# EAGLE schematic draft1 (EAGLE 6.3)
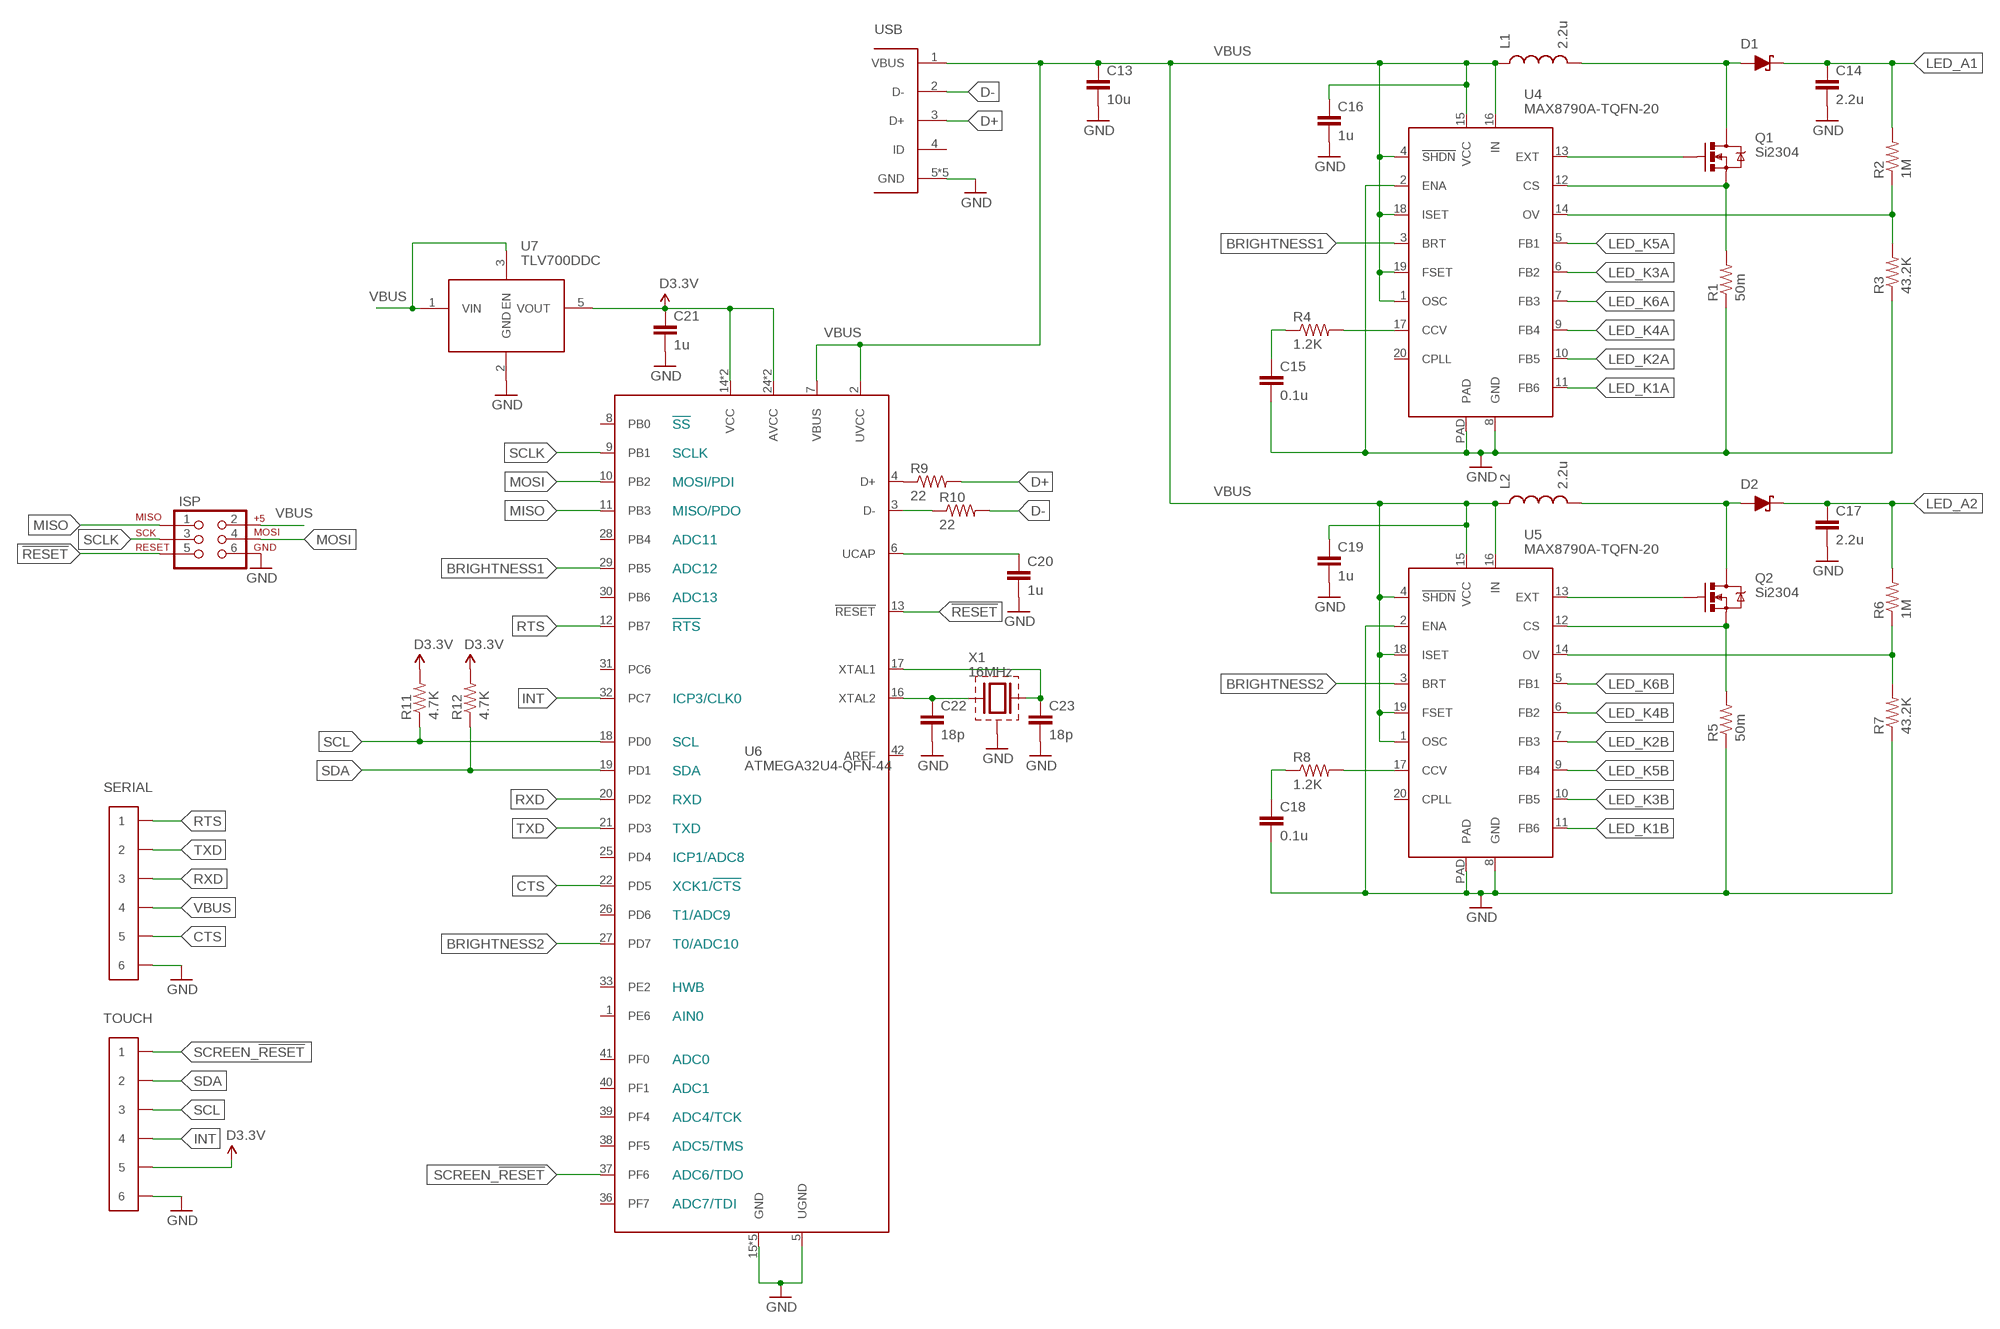
[diagram p0: schematic, sheet 1, part 1 of 2]
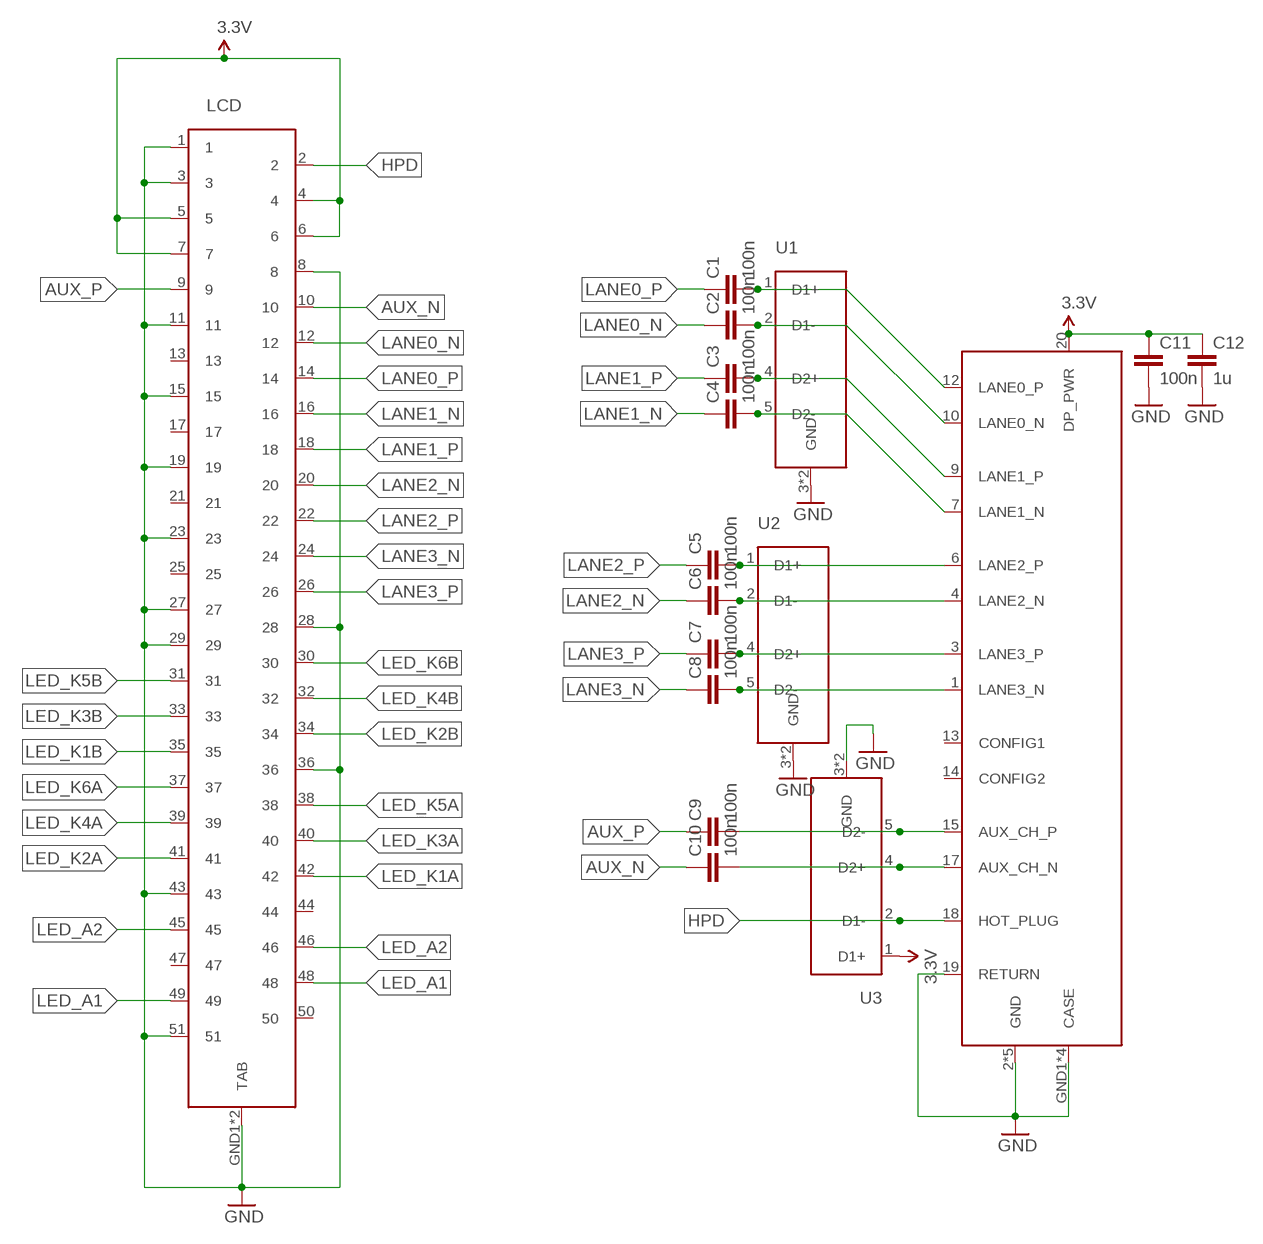
[diagram p1: schematic, sheet 1, part 2 of 2]

## Parts
C1  100n  C-EUC0402  [C0402]
C2  100n  C-EUC0402  [C0402]
C3  100n  C-EUC0402  [C0402]
C4  100n  C-EUC0402  [C0402]
C5  100n  C-EUC0402  [C0402]
C6  100n  C-EUC0402  [C0402]
C7  100n  C-EUC0402  [C0402]
C8  100n  C-EUC0402  [C0402]
C9  100n  C-EUC0402  [C0402]
C10  100n  C-EUC0402  [C0402]
C11  100n  C-EUC0805  [C0805]
C12  1u  C-EUC0805  [C0805]
C13  10u  C-EUC1206  [C1206]
C14  2.2u  C-EUC1206  [C1206]
C15  0.1u  C-EUC0603  [C0603]
C16  1u  C-EUC0603  [C0603]
C17  2.2u  C-EUC1206  [C1206]
C18  0.1u  C-EUC0603  [C0603]
C19  1u  C-EUC0603  [C0603]
C20  1u  C-EUC0603  [C0603]
C21  1u  C-EUC0603  [C0603]
C22  18p  C-EUC0603  [C0603]
C23  18p  C-EUC0603  [C0603]
D1  DB2W40300L  DIODE-SCHOTTKY-MINI2-F3-B  [MINI2-F3-B]
D2  DB2W40300L  DIODE-SCHOTTKY-MINI2-F3-B  [MINI2-F3-B]
DP  DISPLAYPORT-SINK-MOLEX  [MOLEX-47272-0028]
ISP  AVR_SPI_PRG_6PTH  [2X3]
L1  2.2u  INDUCTOR1210  [1210]
L2  2.2u  INDUCTOR1210  [1210]
LCD  CONN-51P-FPC-MOLEX  [MOLEX-502250-5191]
Q1  Si2304  MOSFET-NCHANNELSMD  [SOT23-3]
Q2  Si2304  MOSFET-NCHANNELSMD  [SOT23-3]
R1  50m  R-US_MCS1632  [MCS1632]
R2  1M  R-US_R0603  [R0603]
R3  43.2K  R-US_R0603  [R0603]
R4  1.2K  R-US_R0603  [R0603]
R5  50m  R-US_MCS1632  [MCS1632]
R6  1M  R-US_R0603  [R0603]
R7  43.2K  R-US_R0603  [R0603]
R8  1.2K  R-US_R0603  [R0603]
R9  22  R-US_R0603  [R0603]
R10  22  R-US_R0603  [R0603]
R11  4.7K  R-US_R0603  [R0603]
R12  4.7K  R-US_R0603  [R0603]
SERIAL  HEADER-6X1-961106-5500  [HEADER-3M-961-6P-2.54MM]
TOUCH  HEADER-6X1-FPC-DUAL_CONTACT  [MOLEX-503480-0600]
U1  ESD-SUPPRESSOR-4-TPD4S010-DQA  [SON-10]
U2  ESD-SUPPRESSOR-4-TPD4S010-DQA  [SON-10]
U3  ESD-SUPPRESSOR-4-TPD4S010-DQA  [SON-10]
U4  MAX8790A-TQFN-20  [TQFN-20]
U5  MAX8790A-TQFN-20  [TQFN-20]
U6  ATMEGA32U4-QFN-44  [QFN-44]
U7  TLV700DDC  [SOT-23-5]
USB  USB_MICRO_AB  [USB_MICRO_AB]
X1  16MHz  XTAL-ABRACONABM3C  [ABM3C]

## Nets
3.3V: C11.1 C12.1 DP.20(DP_PWR) LCD.4 LCD.5 LCD.6 LCD.7 U3.1(D1+)
!RESET: ISP.5 U6.13(!RESET)
AUX_N: C10.1 LCD.10
AUX_P: C9.1 LCD.9
BRIGHTNESS1: U4.3(BRT) U6.29(PB5)
BRIGHTNESS2: U5.3(BRT) U6.27(PD7)
CTS: SERIAL.5 U6.22(PD5)
D3.3V: C21.1 R11.2 R12.2 TOUCH.5 U6.14(VCC) U6.24(AVCC) U6.34(VCC) U6.44(AVCC) U7.5(VOUT)
D+: R9.2 USB.3(D+)
D-: R10.2 USB.2(D-)
GND: C11.2 C12.2 C13.2 C14.2 C15.2 C16.2 C17.2 C18.2 C19.2 C20.2 C21.2 C22.2 C23.2 DP.2(GND) DP.5(GND) DP.8(GND) DP.11(GND) DP.16(GND) DP.19(RETURN) DP.GND1(CASE) DP.GND2(CASE) DP.GND3(CASE) DP.GND4(CASE) ISP.6 LCD.1 LCD.3 LCD.8 LCD.11 LCD.15 LCD.19 LCD.23 LCD.27 LCD.28 LCD.29 LCD.36 LCD.43 LCD.51 LCD.GND1(TAB) LCD.GND2(TAB) R1.1 R3.1 R5.1 R7.1 SERIAL.6 TOUCH.6 U1.3(GND) U1.8(GND) U2.3(GND) U2.8(GND) U3.3(GND) U3.8(GND) U4.2(ENA) U4.8(GND) U4.PAD U5.2(ENA) U5.8(GND) U5.PAD U6.5(UGND) U6.15(GND) U6.23(GND) U6.35(GND) U6.43(GND) U6.PAD(GND) U7.2(GND) USB.5(GND) USB.GND1(GND) USB.GND2(GND) USB.GND3(GND) USB.GND4(GND) X1.2(CASE) X1.4(CASE)
HPD: DP.18(HOT_PLUG) LCD.2 U3.2(D1-)
INT: TOUCH.4 U6.32(PC7)
LANE0_N: C2.1 LCD.12
LANE0_P: C1.1 LCD.14
LANE1_N: C4.1 LCD.16
LANE1_P: C3.1 LCD.18
LANE2_N: C6.1 LCD.20
LANE2_P: C5.1 LCD.22
LANE3_N: C8.1 LCD.24
LANE3_P: C7.1 LCD.26
LED_A1: C14.1 D1.1(K) LCD.48 LCD.49 R2.2
LED_A2: C17.1 D2.1(K) LCD.45 LCD.46 R6.2
LED_K1A: LCD.42 U4.11(FB6)
LED_K1B: LCD.35 U5.11(FB6)
LED_K2A: LCD.41 U4.10(FB5)
LED_K2B: LCD.34 U5.7(FB3)
LED_K3A: LCD.40 U4.6(FB2)
LED_K3B: LCD.33 U5.10(FB5)
LED_K4A: LCD.39 U4.9(FB4)
LED_K4B: LCD.32 U5.6(FB2)
LED_K5A: LCD.38 U4.5(FB1)
LED_K5B: LCD.31 U5.9(FB4)
LED_K6A: LCD.37 U4.7(FB3)
LED_K6B: LCD.30 U5.5(FB1)
MISO: ISP.1 U6.11(PB3)
MOSI: ISP.4 U6.10(PB2)
N$1: C4.2 DP.7(LANE1_N) U1.5(D2-)
N$2: C3.2 DP.9(LANE1_P) U1.4(D2+)
N$3: C2.2 DP.10(LANE0_N) U1.2(D1-)
N$4: C1.2 DP.12(LANE0_P) U1.1(D1+)
N$5: C5.2 DP.6(LANE2_P) U2.1(D1+)
N$6: C6.2 DP.4(LANE2_N) U2.2(D1-)
N$7: C7.2 DP.3(LANE3_P) U2.4(D2+)
N$8: C8.2 DP.1(LANE3_N) U2.5(D2-)
N$9: C9.2 DP.15(AUX_CH_P) U3.5(D2-)
N$10: C10.2 DP.17(AUX_CH_N) U3.4(D2+)
N$11: Q1.2(S) R1.2 U4.12(CS)
N$12: Q2.1(G) U5.13(EXT)
N$13: Q1.1(G) U4.13(EXT)
N$14: D1.2(A) L1.2 Q1.3(D)
N$15: R2.1 R3.2 U4.14(OV)
N$16: R4.2 U4.17(CCV)
N$17: C15.1 R4.1
N$18: D2.2(A) L2.2 Q2.3(D)
N$19: Q2.2(S) R5.2 U5.12(CS)
N$20: R6.1 R7.2 U5.14(OV)
N$21: R8.2 U5.17(CCV)
N$22: C18.1 R8.1
N$23: R9.1 U6.4(D+)
N$24: R10.1 U6.3(D-)
N$25: C20.1 U6.6(UCAP)
N$26: C22.1 U6.16(XTAL2) X1.1
N$27: C23.1 U6.17(XTAL1) X1.3
RTS: SERIAL.1 U6.12(PB7)
RXD: SERIAL.3 U6.20(PD2)
SCL: R11.1 TOUCH.3 U6.18(PD0)
SCLK: ISP.3 U6.9(PB1)
SCREEN_!RESET: TOUCH.1 U6.37(PF6)
SDA: R12.1 TOUCH.2 U6.19(PD1)
TXD: SERIAL.2 U6.21(PD3)
VBUS: C13.1 C16.1 C19.1 ISP.2 L1.1 L2.1 SERIAL.4 U4.1(OSC) U4.4(!SHDN) U4.15(VCC) U4.16(IN) U4.18(ISET) U4.19(FSET) U5.1(OSC) U5.4(!SHDN) U5.15(VCC) U5.16(IN) U5.18(ISET) U5.19(FSET) U6.2(UVCC) U6.7(VBUS) U7.1(VIN) U7.3(EN) USB.1(VBUS)
Unconnected: DP.13(CONFIG1) DP.14(CONFIG2) LCD.13 LCD.17 LCD.21 LCD.25 LCD.44 LCD.47 LCD.50 U4.20(CPLL) U5.20(CPLL) U6.1(PE6) U6.8(PB0) U6.25(PD4) U6.26(PD6) U6.28(PB4) U6.30(PB6) U6.31(PC6) U6.33(PE2) U6.36(PF7) U6.38(PF5) U6.39(PF4) U6.40(PF1) U6.41(PF0) U6.42(AREF) USB.4(ID)

## Library data of the parts
C1-C23 = 00-EvaLibrary:C-EU: CAPACITOR, European symbol
D1 D2 = 00-EvaLibrary:DIODE-SCHOTTKY
DP = 00-EvaLibrary:DISPLAYPORT
ISP = SparkFun-Connectors:AVR_SPI_PRG_6: AVR ISP 6 Pin This is the reduced ISP connector for AVR programming. Common on Arduino. This footprint will take up less PCB space and can be used with a 10-pin to 6-pin adapter such as SKU: BOB-08508
L1 L2 = 00-EvaLibrary:INDUCTOR: Inductors Basic Inductor/Choke - 0603 and 1206. Footprints are not proven and vary greatly between part numbers.
LCD = 00-EvaLibrary:CONN-51P
Q1 Q2 = SparkFun-DiscreteSemi:MOSFET-NCHANNEL: Generic NMOS footprint
R1-R12 = 00-EvaLibrary:R-US_: RESISTOR, American symbol
SERIAL TOUCH = 00-EvaLibrary:HEADER-6X1
U1-U3 = 00-EvaLibrary:ESD-SUPPRESSOR-4
U4 U5 = 00-EvaLibrary:MAX8790A
U6 = 00-EvaLibrary:ATMEGA32U4
U7 = 00-EvaLibrary:TLV700
USB = 00-EvaLibrary:USB_MICRO_AB
X1 = 00-EvaLibrary:XTAL-ABRACON